# Altium schematic sheet MAGI'sDIPBoard-Python.SchDoc
size A4
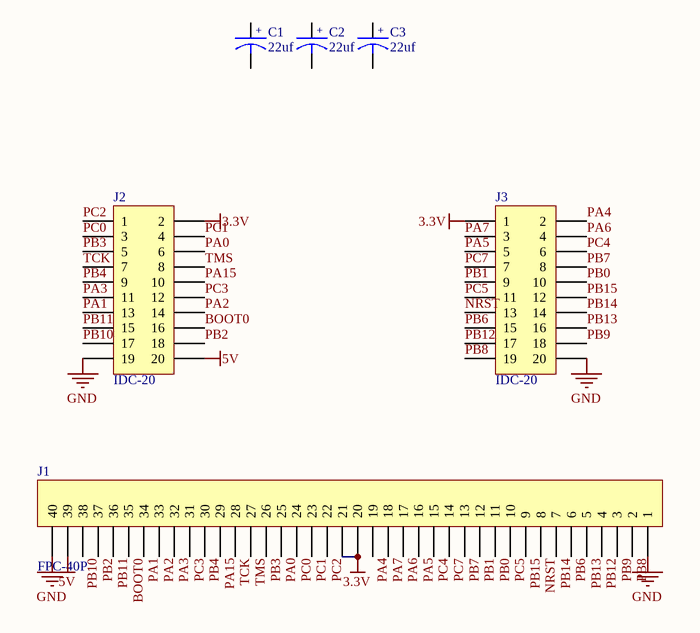
[diagram p0: MAGI'sDIPBoard-Python.SchDoc]

## Parts
C1  22uf  [C1210_N]
C2  22uf  [C1210_N]
C3  22uf  [C1210_N]
J1  FPC-40P  [FFC/SM0.5-2H40]
J2  IDC-20  [IDC-20]
J3  IDC-20  [IDC-20]

## Nets
3.3V: J1.20 J1.21 J2.2 J3.1
5V: J1.39 J2.20
GND: J1.1 J1.40 J2.19 J3.20
BOOT0: J1.35 J2.16
NRST: J1.8 J3.13
PA0: J1.25 J2.6
PA1: J1.34 J2.13
PA2: J1.33 J2.14
PA3: J1.32 J2.11
PA4: J1.19 J3.2
PA5: J1.16 J3.5
PA6: J1.17 J3.4
PA7: J1.18 J3.3
PA15: J1.29 J2.10
PB0: J1.11 J3.10
PB1: J1.12 J3.9
PB2: J1.37 J2.18
PB3: J1.26 J2.5
PB4: J1.30 J2.9
PB6: J1.6 J3.15
PB7: J1.13 J3.8
PB8: J1.2 J3.19
PB9: J1.3 J3.18
PB10: J1.38 J2.17
PB11: J1.36 J2.15
PB12: J1.4 J3.17
PB13: J1.5 J3.16
PB14: J1.7 J3.14
PB15: J1.9 J3.12
PC0: J1.24 J2.3
PC1: J1.23 J2.4
PC2: J1.22 J2.1
PC3: J1.31 J2.12
PC4: J1.15 J3.6
PC5: J1.10 J3.11
PC7: J1.14 J3.7
TCK: J1.28 J2.7
TMS: J1.27 J2.8

Not connected (* = marked no-connect by the designer): C1 1 2; C2 1 2; C3 1 2

## Notes on the sheet
- (in symbol CAPACITOR POL) +

## Library data of the parts
C1-C3 = CAPACITOR POL: Capacitor
J1 = CON40: Connector